# EAGLE design etch-a-sketch (EAGLE 9.6.2)
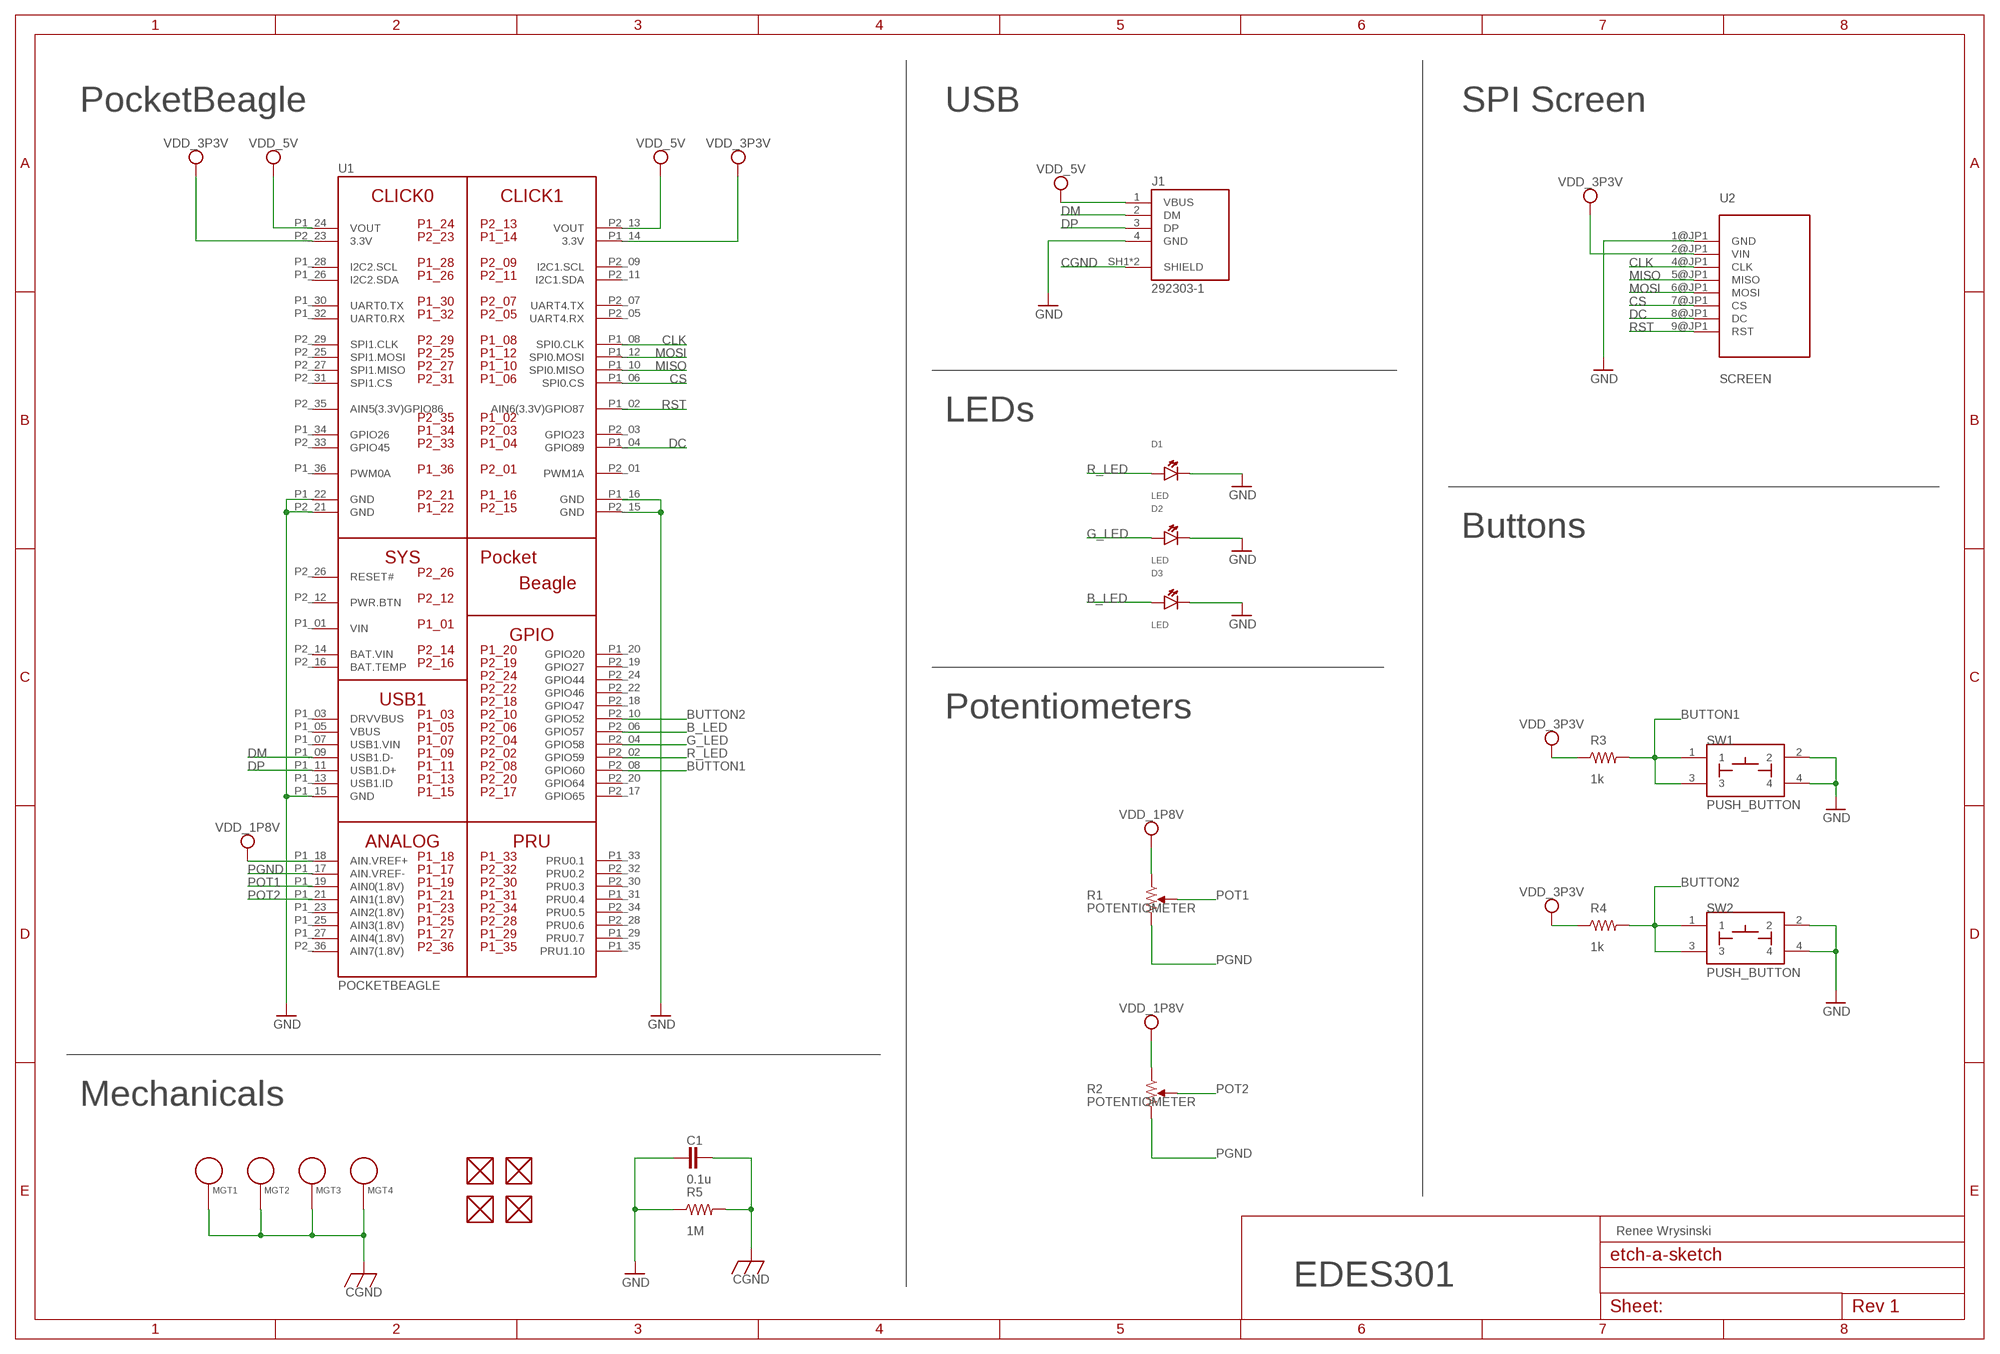
[diagram p0: schematic, sheet 1]

## Parts
C1  0.1u  C_C0603  [C0603]
D1  LED  [EIA-STD]
D2  LED  [EIA-STD]
D3  LED  [EIA-STD]
FUD1  FIDUCIAL  [FIDUCIAL_40MIL]
FUD2  FIDUCIAL  [FIDUCIAL_40MIL]
FUD3  FIDUCIAL  [FIDUCIAL_40MIL]
FUD4  FIDUCIAL  [FIDUCIAL_40MIL]
J1  292303-1  [TE_292303-1]
MGT1  MOUNTING_HOLE  [MOUNTING_HOLE]
MGT2  MOUNTING_HOLE  [MOUNTING_HOLE]
MGT3  MOUNTING_HOLE  [MOUNTING_HOLE]
MGT4  MOUNTING_HOLE  [MOUNTING_HOLE]
R1  POTENTIOMETER  [POT-PO90S]
R2  POTENTIOMETER  [POT-PO90S]
R3  1k  R_R0603  [R0603]
R4  1k  R_R0603  [R0603]
R5  1M  R_R0603  [R0603]
SW1  PUSH_BUTTON  [BUTTON_12.5MM]
SW2  PUSH_BUTTON  [BUTTON_12.5MM]
U1  POCKETBEAGLE  [POCKETBEAGLE]
U2  SCREEN  ADAFRUIT_2.8_TFT_BREAKOUT_V2  [ADAFRUIT_2.8_TFT_BREAKOUT_V2]

## Nets
B_LED: D3.ANODE U1.P2_06(GPIO57)
BUTTON1: R3.2 SW1.1 SW1.3 U1.P2_08(GPIO60)
BUTTON2: R4.2 SW2.1 SW2.3 U1.P2_10(GPIO52)
CGND [pwr/gnd]: C1.2 J1.SH1(SHIELD) J1.SH2(SHIELD) MGT1.P$1 MGT2.P$1 MGT3.P$1 MGT4.P$1 R5.2
CLK: U1.P1_08(SPI0.CLK) U2.4@JP1(CLK)
CS: U1.P1_06(SPI0.CS) U2.7@JP1(CS)
DC: U1.P1_04(GPIO89) U2.8@JP1(DC)
DM: J1.2(DM) U1.P1_09(USB1.D-)
DP: J1.3(DP) U1.P1_11(USB1.D+)
G_LED: D2.ANODE U1.P2_04(GPIO58)
GND [pwr/gnd]: C1.1 D1.CATHODE D2.CATHODE D3.CATHODE J1.4(GND) R5.1 SW1.2 SW1.4 SW2.2 SW2.4 U1.P1_15(GND) U1.P1_16(GND) U1.P1_22(GND) U1.P2_15(GND) U1.P2_21(GND) U2.1@JP1(GND)
MISO: U1.P1_10(SPI0.MISO) U2.5@JP1(MISO)
MOSI: U1.P1_12(SPI0.MOSI) U2.6@JP1(MOSI)
PGND: R1.CW R2.CW U1.P1_17(AIN.VREF-)
POT1: R1.S U1.P1_19(AIN0(1.8V))
POT2: R2.S U1.P1_21(AIN1(1.8V))
R_LED: D1.ANODE U1.P2_02(GPIO59)
RST: U1.P1_02(AIN6(3.3V)GPIO87) U2.9@JP1(RST)
VDD_1P8V: R1.CCW R2.CCW U1.P1_18(AIN.VREF+)
VDD_3P3V [pwr/gnd]: R3.1 R4.1 U1.P1_14(3.3V) U1.P2_23(3.3V) U2.2@JP1(VIN)
VDD_5V [pwr/gnd]: J1.1(VBUS) U1.P1_24(VOUT) U1.P2_13(VOUT)
Unconnected: FUD1.P$1 FUD2.P$1 FUD3.P$1 FUD4.P$1 U1.P1_03(DRVVBUS) U1.P1_05(VBUS) U1.P1_07(USB1.VIN) U1.P1_13(USB1.ID) U1.P1_20(GPIO20) U1.P1_23(AIN2(1.8V)) U1.P1_25(AIN3(1.8V)) U1.P1_26(I2C2.SDA) U1.P1_27(AIN4(1.8V)) U1.P1_28(I2C2.SCL) U1.P1_29(PRU0.7) U1.P1_30(UART0.TX) U1.P1_31(PRU0.4) U1.P1_32(UART0.RX) U1.P1_33(PRU0.1) U1.P1_34(GPIO26) U1.P1_35(PRU1.10) U1.P1_36(PWM0A) U1.P2_01(PWM1A) U1.P2_03(GPIO23) U1.P2_05(UART4.RX) U1.P2_07(UART4.TX) U1.P2_09(I2C1.SCL) U1.P2_11(I2C1.SDA) U1.P2_12(PWR.BTN) U1.P2_16(BAT.TEMP) U1.P2_17(GPIO65) U1.P2_18(GPIO47) U1.P2_19(GPIO27) U1.P2_20(GPIO64) U1.P2_22(GPIO46) U1.P2_24(GPIO44) U1.P2_25(SPI1.MOSI) U1.P2_26(RESET#) U1.P2_27(SPI1.MISO) U1.P2_28(PRU0.6) U1.P2_29(SPI1.CLK) U1.P2_30(PRU0.3) U1.P2_31(SPI1.CS) U1.P2_32(PRU0.2) U1.P2_33(GPIO45) U1.P2_34(PRU0.5) U1.P2_35(AIN5(3.3V)GPIO86) U1.P2_36(AIN7(1.8V))

## Notes on the sheet
- PocketBeagle | USB | SPI Screen
- LEDs
- Buttons
- Potentiometers
- Mechanicals
- Renee Wrysinski
- EDES301

## Power pins joined to a net without a drawn wire
BAT.VIN: U1.P2_14(BAT.VIN)
VIN: U1.P1_01(VIN)

## Library data of the parts
C1 = MISC:C_: Capacitor SMD. Sizes: 0402, 0603 & 0805
D1-D3 = combo_lock:LED: EIA-STD LED, LTST-C191TBKT
FUD1-FUD4 = MISC:FIDUCIAL
J1 = combo_lock:292303-1: CONN USB RECEPT R/A TYPE A 4POS Check availability <https://pricing.snapeda.com/parts/292303-1/TE%20Connectivity/view-part?ref=eda>; AVAILABILITY: In Stock; CENTERLINE_PITCH: 2 mm[.078 in]; COMMENT: 292303-1; DESCRIPTION: Conn; Data; USB; Recept; 2.0; 4 Pos; 1 Port; Rt Angle; A Ser; Tin over Copper; EU_ROHS_COMPLIANCE: Compliant; MF: TE Connectivity; MP: 292303-1; NUMBER_OF_POSITIONS: 4; PACKAGE: None; PRICE: None; PRODUCT_TYPE: Connector; PURCHASE-URL: https://pricing.snapeda.com/search/part/292303-1/?ref=eda
MGT1-MGT4 = MISC:MOUNTING_HOLE: Chassis Mounting Hole w/GND connection ability
R1 R2 = combo_lock:POTENTIOMETER: Potentiometer - Examples: P090S-14T20BR10K (987-1277-ND)
R3-R5 = MISC:R_: RESISTOR, American symbol
SW1 SW2 = combo_lock:PUSH_BUTTON
U1 = combo_lock:POCKETBEAGLE
U2 = MISC:ADAFRUIT_2.8_TFT_BREAKOUT_V2

## Net classes
0 default: width 0.254 mm, drill 0.305 mm, clearance 0.254 mm
1 pwr/gnd: width 0.381 mm, drill 0.305 mm, clearance 0.381 mm

## Board
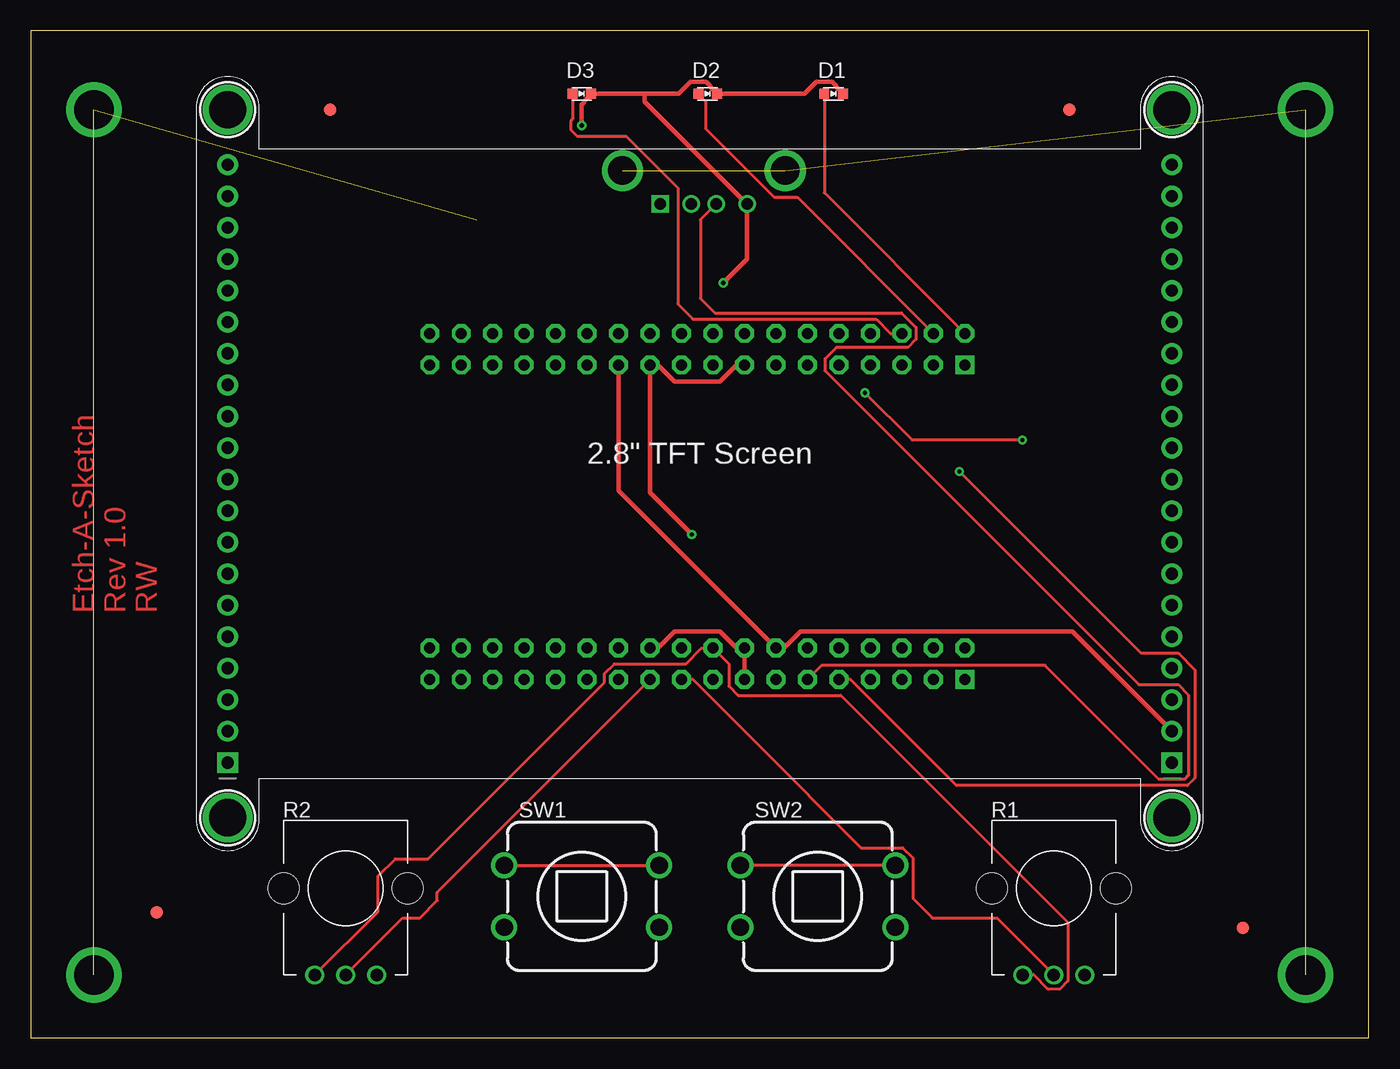
[diagram p1: board, top side]
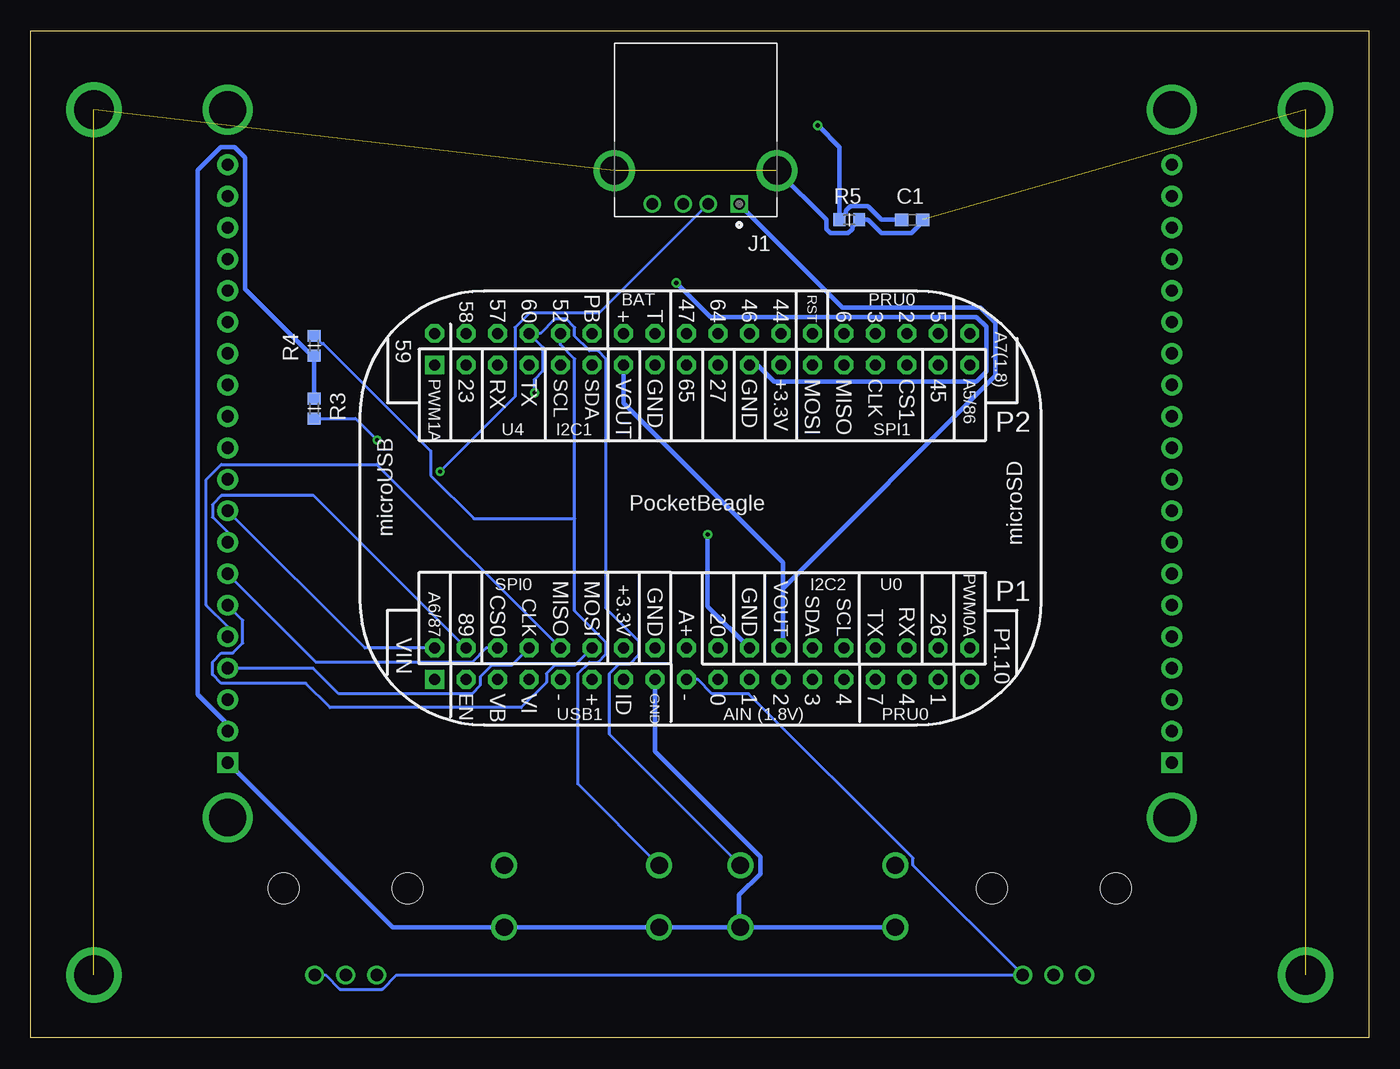
[diagram p2: board, bottom side, seen from below]

Size 107.95 x 81.28 mm. Coordinates in mm from the lower left corner, seen from the top.
Outline: 0,0 107.95,0 107.95,81.28 0,81.28 0,0
Copper layers (1*16): Top 0.035mm / dielectric 1.5mm / Bottom 0.035mm
Design rules "default": minimum track width 6mil, minimum drill 0.35mm, track to track 6mil, track to pad 6mil, pad to pad 6mil, via to via 6mil, smd to smd 6mil, copper to edge 40mil, drill to drill 6mil, minimum pad ring 10mil, minimum via ring 8mil, stop-mask expansion 4mil, vias tented up to drill 0mil, thermal gap 10mil

### Footprints (pad centres in the part's own frame; a part is rotated, then mirrored left to right if it is on the bottom)
C0603 = smd 1.1 x 1: 1 -0.85,0; 2 0.85,0
EIA-STD = smd 0.8 x 0.8: ANODE -0.75,0; CATHODE 0.75,0
FIDUCIAL_40MIL = smd 1.016 x 1.016: P$1 0,0
TE_292303-1 = drill 0.92 square: 1 0,0 | drill 0.92: 2 2.5,0; 3 4.5,0; 4 7,0 | drill 2.3: SH1 -3.07,-2.71; SH2 10.07,-2.71
MOUNTING_HOLE = drill 3.175 pad 4.445: P$1 0,0
POT-PO90S = drill 1: CCW -2.5,0; CW 2.5,0; S 0,0 | hole 2.5: -5,7; 5,7
R0603 = smd 0.95 x 1.031: 1 -0.8,0; 2 0.8,0
BUTTON_12.5MM = drill 1.4: 1 -6.25,2.5; 2 -6.25,-2.5; 3 6.25,2.5; 4 6.25,-2.5
POCKETBEAGLE = drill 0.889 pad 1.524 square: P1_01 5.91,3.53; P2_01 5.91,28.93 | drill 0.889 pad 1.524 octagon: P1_02 5.91,6.07; P1_03 8.45,3.53; P1_04 8.45,6.07; P1_05 10.99,3.53; P1_06 10.99,6.07; P1_07 13.53,3.53; P1_08 13.53,6.07; P1_09 16.07,3.53; P1_10 16.07,6.07; P1_11 18.61,3.53; P1_12 18.61,6.07; P1_13 21.15,3.53; P1_14 21.15,6.07; P1_15 23.69,3.53; P1_16 23.69,6.07; P1_17 26.23,3.53; P1_18 26.23,6.07; P1_19 28.77,3.53; P1_20 28.77,6.07; P1_21 31.31,3.53; P1_22 31.31,6.07; P1_23 33.85,3.53; P1_24 33.85,6.07; P1_25 36.39,3.53; P1_26 36.39,6.07; P1_27 38.93,3.53; P1_28 38.93,6.07; P1_29 41.47,3.53; P1_30 41.47,6.07; P1_31 44.01,3.53; P1_32 44.01,6.07; P1_33 46.55,3.53; P1_34 46.55,6.07; P1_35 49.09,3.53; P1_36 49.09,6.07; P2_02 5.91,31.47; P2_03 8.45,28.93; P2_04 8.45,31.47; P2_05 10.99,28.93; P2_06 10.99,31.47; P2_07 13.53,28.93; P2_08 13.53,31.47; P2_09 16.07,28.93; P2_10 16.07,31.47; P2_11 18.61,28.93; P2_12 18.61,31.47; P2_13 21.15,28.93; P2_14 21.15,31.47; P2_15 23.69,28.93; P2_16 23.69,31.47; P2_17 26.23,28.93; P2_18 26.23,31.47; P2_19 28.77,28.93; P2_20 28.77,31.47; P2_21 31.31,28.93; P2_22 31.31,31.47; P2_23 33.85,28.93; P2_24 33.85,31.47; P2_25 36.39,28.93; P2_26 36.39,31.47; P2_27 38.93,28.93; P2_28 38.93,31.47; P2_29 41.47,28.93; P2_30 41.47,31.47; P2_31 44.01,28.93; P2_32 44.01,31.47; P2_33 46.55,28.93; P2_34 46.55,31.47; P2_35 49.09,28.93; P2_36 49.09,31.47
ADAFRUIT_2.8_TFT_BREAKOUT_V2 = drill 1 pad 1.676 square: 1@JP1 55.88,78.74; 1@JP2 55.88,2.54 | drill 1 pad 1.676: 2@JP1 53.34,78.74; 2@JP2 53.34,2.54; 3@JP1 50.8,78.74; 3@JP2 50.8,2.54; 4@JP1 48.26,78.74; 4@JP2 48.26,2.54; 5@JP1 45.72,78.74; 5@JP2 45.72,2.54; 6@JP1 43.18,78.74; 6@JP2 43.18,2.54; 7@JP1 40.64,78.74; 7@JP2 40.64,2.54; 8@JP1 38.1,78.74; 8@JP2 38.1,2.54; 9@JP1 35.56,78.74; 9@JP2 35.56,2.54; 10@JP1 33.02,78.74; 10@JP2 33.02,2.54; 11@JP1 30.48,78.74; 11@JP2 30.48,2.54; 12@JP1 27.94,78.74; 12@JP2 27.94,2.54; 13@JP1 25.4,78.74; 13@JP2 25.4,2.54; 14@JP1 22.86,78.74; 14@JP2 22.86,2.54; 15@JP1 20.32,78.74; 15@JP2 20.32,2.54; 16@JP1 17.78,78.74; 16@JP2 17.78,2.54; 17@JP1 15.24,78.74; 17@JP2 15.24,2.54; 18@JP1 12.7,78.74; 18@JP2 12.7,2.54; 19@JP1 10.16,78.74; 19@JP2 10.16,2.54; 20@JP1 7.62,78.74; 20@JP2 7.62,2.54 | drill 3 pad 3.6: P$1@U$7 3.175,2.54; P$1@U$15 60.325,2.54; P$1@U$16 3.175,78.74; P$1@U$17 60.325,78.74

### Placement (x,y rotation side)
C1  36.83,66.04 0 bottom
D1  64.77,76.2 0 top
D2  54.61,76.2 0 top
D3  44.45,76.2 0 top
FUD1  97.79,8.89 0 top
FUD2  10.16,10.16 0 top
FUD3  83.82,74.93 0 top
FUD4  24.13,74.93 0 top
J1  50.8,67.31 180 bottom
MGT1  5.08,74.93 0 top
MGT2  102.87,74.93 0 top
MGT3  102.87,5.08 0 top
MGT4  5.08,5.08 0 top
R1  82.55,5.08 0 top
R2  25.4,5.08 0 top
R3  85.09,50.8 270 bottom
R4  85.09,55.88 90 bottom
R5  41.91,66.04 0 bottom
SW1  44.45,11.43 0 top
SW2  63.5,11.43 0 top
U1  81.28,25.4 0 bottom
U2  13.34,78.11 270 top

### Tracks (layer width: path | path; a pad name or v marks a point on that pad's centre or on a via)
B_LED
  Top 0.254: U1.P2_06 69.37,56.87 68.22,58.01 53.43,58.01 52.2,59.24 52.2,68.61 48.04,72.77 44.08,72.77 43.56,73.29 43.56,74.03 43.7,74.16 D3.ANODE
BUTTON1  (via drill 0.35)
  Top 0.254: SW1.1 SW1.3 | v80.01,48.26 71.12,48.26 v67.31,52.07
  Bottom 0.254: SW1.3 61.27,24.5 61.27,29.4 60.48,30.2 59.6,30.2 58.86,30.94 58.86,32 61.53,34.66 61.53,54.8 62.2,55.47 62.89,55.47 64.07,56.65 64.07,57.34 64.74,58.01 65.68,58.01 66.83,56.87 U1.P2_08 66.61,55.73 66.61,53.86 67.31,53.15 v67.31,52.07 | R3.2 81.75,50 v80.01,48.26
BUTTON2
  Top 0.254: SW2.3 SW2.1
  Bottom 0.254: U1.P2_10 65.21,55.95 64.07,54.8 64.07,41.91 | SW2.1 63.81,20.49 63.81,29.4 62.89,30.33 62.2,30.33 61.53,31 61.53,31.94 64.07,34.48 64.07,41.91 | R4.2 84.47,56.06 84.36,56.06 75.69,47.39 75.69,45.41 72.19,41.91 64.07,41.91
CGND  (5 unrouted)
  Bottom 0.381: C1.2 35.98,65.88 36.89,64.97 39.32,64.97 40.39,66.04 R5.2 41.66,65.49 41.66,65.29 42,64.95 43.42,64.95 43.76,65.29 43.76,66.05 J1.SH1
CLK
  Bottom 0.254: U2.4@JP1 85.17,29.84 83.11,27.79 72.36,27.79 71.69,28.46 71.69,29.15 70.76,30.07 69.15,30.07 U1.P1_08
CS
  Bottom 0.254: U1.P1_06 71.21,31.47 72.36,30.33 84.94,30.33 U2.7@JP1
DC
  Bottom 0.254: U2.8@JP1 92.08,40.82 93.29,42.04 93.29,43.05 92.58,43.76 85.12,43.76 U1.P1_04
DM  (via drill 0.35)
  Top 0.254: v74.93,45.72 89.59,31.06 92.58,31.06 93.93,29.71 93.93,20.97 93.33,20.37 74.69,20.37 66.13,28.93 U1.P1_09
  Bottom 0.254: J1.2 62.09,58.52 67.72,58.52 68.89,57.34 68.89,51.76 v74.93,45.72
DP
  Top 0.254: J1.3 54.03,66.04 54.03,59.69 55.2,58.52 70.25,58.52 71.43,57.34 71.43,56.4 70.76,55.73 64.99,55.73 64.07,54.8 64.07,53.86 89.4,28.52 92.58,28.52 93.42,27.68 93.42,21.18 93.12,20.88 91.03,20.88 81.83,30.07 63.81,30.07 U1.P1_11
G_LED
  Top 0.254: D2.ANODE 54.45,75.61 54.45,73.38 59.97,67.85 61.85,67.85 U1.P2_04
GND  (via drill 0.35)
  Top 0.381: U1.P2_15 56.94,54.33 55.6,53 51.96,53 50.62,54.33 U1.P2_21 49.97,44.01 v53.34,40.64 | U1.P1_22 50.62,31.47 51.96,32.8 55.6,32.8 56.94,31.47 U1.P1_16 U1.P1_15 | v44.45,73.66 44.45,75.34 44.67,75.56 44.67,75.67 D3.CATHODE 49.53,76.2 | 49.53,76.2 52.25,76.2 53.22,77.17 54.5,77.17 54.83,76.84 54.83,76.73 D2.CATHODE 62.41,76.2 63.38,77.17 64.66,77.17 64.99,76.84 64.99,76.73 D1.CATHODE | 49.53,76.2 49.53,75.58 J1.4 57.8,62.88 v55.88,60.96
  Bottom 0.381: U2.1@JP1 78.78,8.93 SW2.4 SW2.2 50.8,8.93 | 50.8,8.93 SW1.4 SW1.2 | C1.1 39.31,66.04 40.4,67.13 41.82,67.13 42.16,66.79 42.16,66.59 R5.1 42.71,71.92 v44.45,73.66 | U1.P1_15 57.59,23.11 49.08,14.6 49.08,13.26 50.8,11.54 50.8,8.93 | v53.34,40.64 53.34,34.84 U1.P1_22 | v55.88,60.96 53.12,58.2 31.64,58.2 30.86,57.42 30.86,53.78 31.64,53 47.98,53 49.32,54.33 U1.P2_21
MISO
  Bottom 0.254: U1.P1_10 80.04,46.3 92.58,46.3 93.8,45.08 93.8,34.93 92.08,33.2 U2.5@JP1
MOSI
  Bottom 0.254: U1.P1_12 64.07,30.07 65.68,30.07 66.35,29.4 66.35,28.71 68.39,26.67 83.82,26.67 85.78,28.63 92.58,28.63 93.29,29.34 93.29,30.35 92.58,31.06 91.67,31.06 90.86,31.88 90.86,33.71 U2.6@JP1
PGND
  Bottom 0.254: R1.CW 84.16,5.08 83.02,3.94 79.58,3.94 78.44,5.08 R2.CW 36.77,13.95 36.77,14.52 50.03,27.79 52.98,27.79 54.13,28.93 U1.P1_17
POT1
  Top 0.254: R1.S 77.94,9.69 72.75,9.69 71.18,11.26 71.18,14.52 70.34,15.36 67,15.36 58.51,23.85 53.43,28.93 U1.P1_19
POT2
  Top 0.254: R2.S 30.01,9.69 31.39,9.69 32.79,11.09 32.79,11.75 U1.P1_21
R_LED
  Top 0.254: D1.ANODE 64.02,68.22 U1.P2_02
RST
  Bottom 0.254: U1.P1_02 81,31.47 U2.9@JP1
VDD_1P8V
  Top 0.254: R2.CCW 28.01,10.19 28.01,13.07 29.41,14.47 32.05,14.47 46.29,28.71 46.29,29.4 47.08,30.2 52.86,30.2 54.13,31.47 U1.P1_18 56.32,30.2 56.32,28.4 57.06,27.66 65.35,27.66 83.69,9.33 83.69,4.61 83.02,3.94 82.08,3.94 80.94,5.08 R1.CCW
VDD_3P3V
  Top 0.381: U1.P2_23 47.43,44.17 U1.P1_14 60.78,31.47 62.12,32.8 84.04,32.8 U2.2@JP1
  Bottom 0.381: U2.2@JP1 92.08,25.31 94.5,27.74 94.5,70.05 92.66,71.89 91.49,71.89 90.67,71.07 90.67,60.46 85.29,55.08 R4.1 R3.1
VDD_5V
  Bottom 0.381: U1.P2_13 60.13,51.24 47.27,38.38 47.27,36.29 | U1.P1_24 47.27,31.47 47.27,36.29 | J1.1 42.46,58.97 31.32,58.97 30.09,57.74 30.09,53.46 47.27,36.29

### Text on the board
Top: Etch-A-Sketch | Rev 1.0 | RW